# Altium schematic sheet eNCODER.SchDoc
size OrCAD A
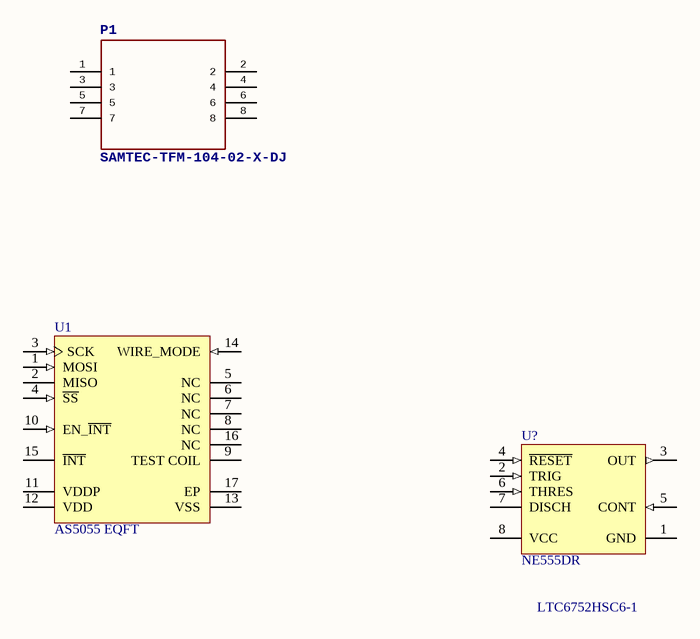
[diagram p0: eNCODER.SchDoc]

## Parts
P1  SAMTEC-TFM-104-02-X-DJ  [SAMTEC-TFM-104-02-X-D]
U1  AS5055 EQFT  [AMS-QFN-16-4000X4000DE-2400X2400TP_N]
U?  NE555DR  [D0008A_M]

## Nets

Not connected (* = marked no-connect by the designer): P1 1 2 3 4 5 6 7 8; U1 1(MOSI) 2(MISO) 3(SCK) 4(~{SS}) 5(NC) 6(NC) 7(NC) 8(NC) 9(TEST_COIL) 10(EN_~{INT}) 11(VDDP) 12(VDD) 13(VSS) 14(WIRE_MODE) 15(~{INT}) 16(NC) 17(EP); U? 1(GND) 2(TRIG) 3(OUT) 4(~{RESET}) 5(CONT) 6(THRES) 7(DISCH) 8(VCC)

## Notes on the sheet
- LTC6752HSC6-1
- Title
- Size:
- Date:
- Orcad A
- Number:
- Time:
- Revision:
- Sheet
- of
- ZLS Corporation
- 7801 North Lamar Blvd.
- Suite E-184
- Austin, Texas 78752  USA
- (512) 453-0288
- File:

## Library data of the parts
U1 = CMP-0870-00001-1: 12-Bit Rotary Position Sensor with Digital Interface, 3 to 3.6 V, -40 to 85 degC, QFN-16, Pb-Free, Reel; Manufacturer: AMS; Supply Voltage (V): 3.0 to 3.6; Resolution: 12 bit; Output: SPI Interface; ComponentLink1Description: Manufacturer URL; Features: low power consumption, automatic wakeup over serial interface, small size, SPI interface; PackageReference: QFN-16 (4x4x0.85mm); ComponentLink2URL: http://www.ams.com/eng/content/download/383163/1241077/19752; ComponentLink2Description: Datasheet; DatasheetVersion: Rev. 1.16; Mounting Technology: Surface Mount; PackageDescription: 16-Pin Plastic Quad Flatpack, No Leads, 4 x 4 mm Body, 0.65 mm Pitch, 2.4 x 2.4 mm Exposed Pad; PartNumber: AS5055 EQFT; PackageVersion: Rev. 3.7, 06/2011; ComponentLink1URL: www.ams.com
U? = CMP-1685-00007-1: Precision Timer, 4.5 to 16 V, 0 to 70 degC, 8-Pin SOIC (D8), Green (RoHS & no Sb/Br), Tape and Reel; Forward Voltage: 450 mV; Forward Current: 1 A; Max Surge Current: 30 A; Peak Reverse Current: 500 uA; Case\Package: SMA; PackageReference: D0008A; Width: 2.84 mm; PackageDescription: 8-Pin Small Outline Integrated Circuit, Body 4.9 x 3.9 mm, Pitch 1.27 mm; DatasheetVersion: SLFS022I, 09/2014; ComponentLink2Description: Datasheet; Package Quantity: 1; REACH SVHC: Unknown; Radiation Hardening: No; Height: 2.44 mm; Code_JEDEC: MS-012; Pins: 2; ComponentLink1Description: Manufacturer URL; ComponentLink3Description: Package Specification; ComponentLink3URL: http://www.ti.com/lit/ml/msoi002j/msoi002j.pdf; Length: 4.57 mm; ComponentLink1URL: http://www.ti.com/; Mount: Surface Mount; PackageVersion: 4040047-3/M, 06/2011; ComponentLink2URL: http://www.ti.com/general/docs/lit/getliterature.tsp?genericPartNumber=NE555&fileType=pdf; RoHSCompliant: true; Max Operating Temperature: 125 degC; Packaging: Cut Tape; Min Operating Temperature: -55 degC